# Altium schematic sheet INFO.SchDoc
size 558 x 431 mm; SheetNumber: 2; SheetTotal: 25; Sheet_Name: INFO; Size: 11x17
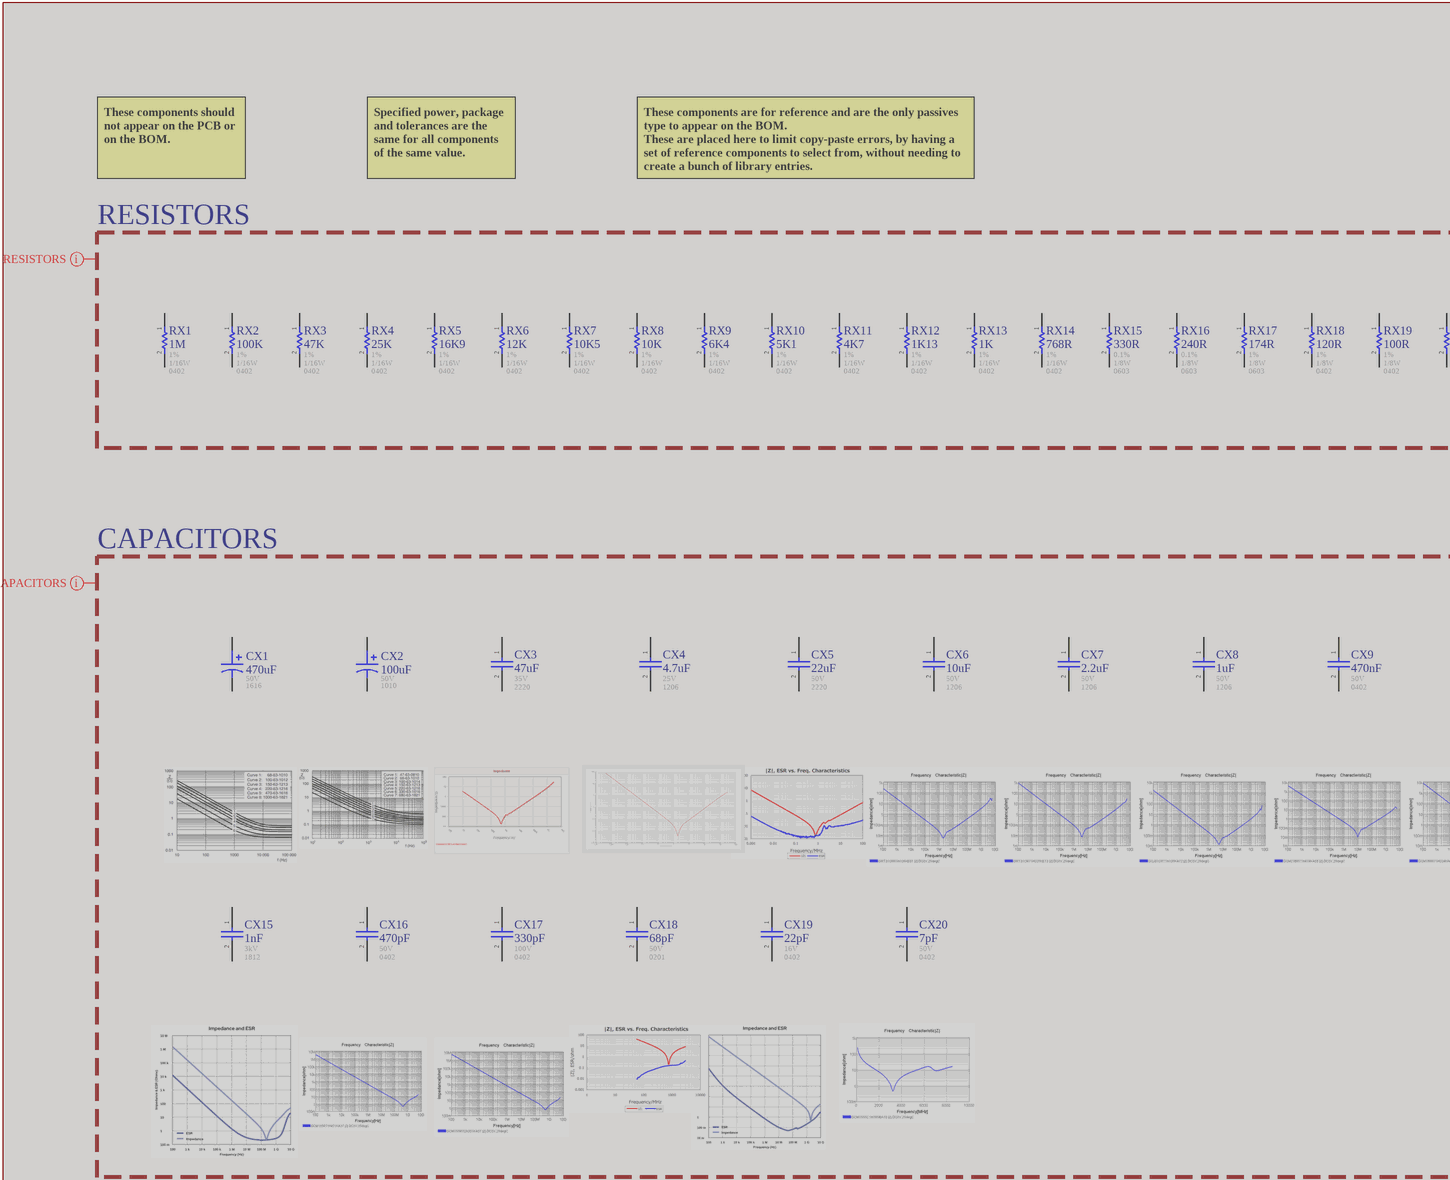
[diagram p0: INFO.SchDoc, top left]
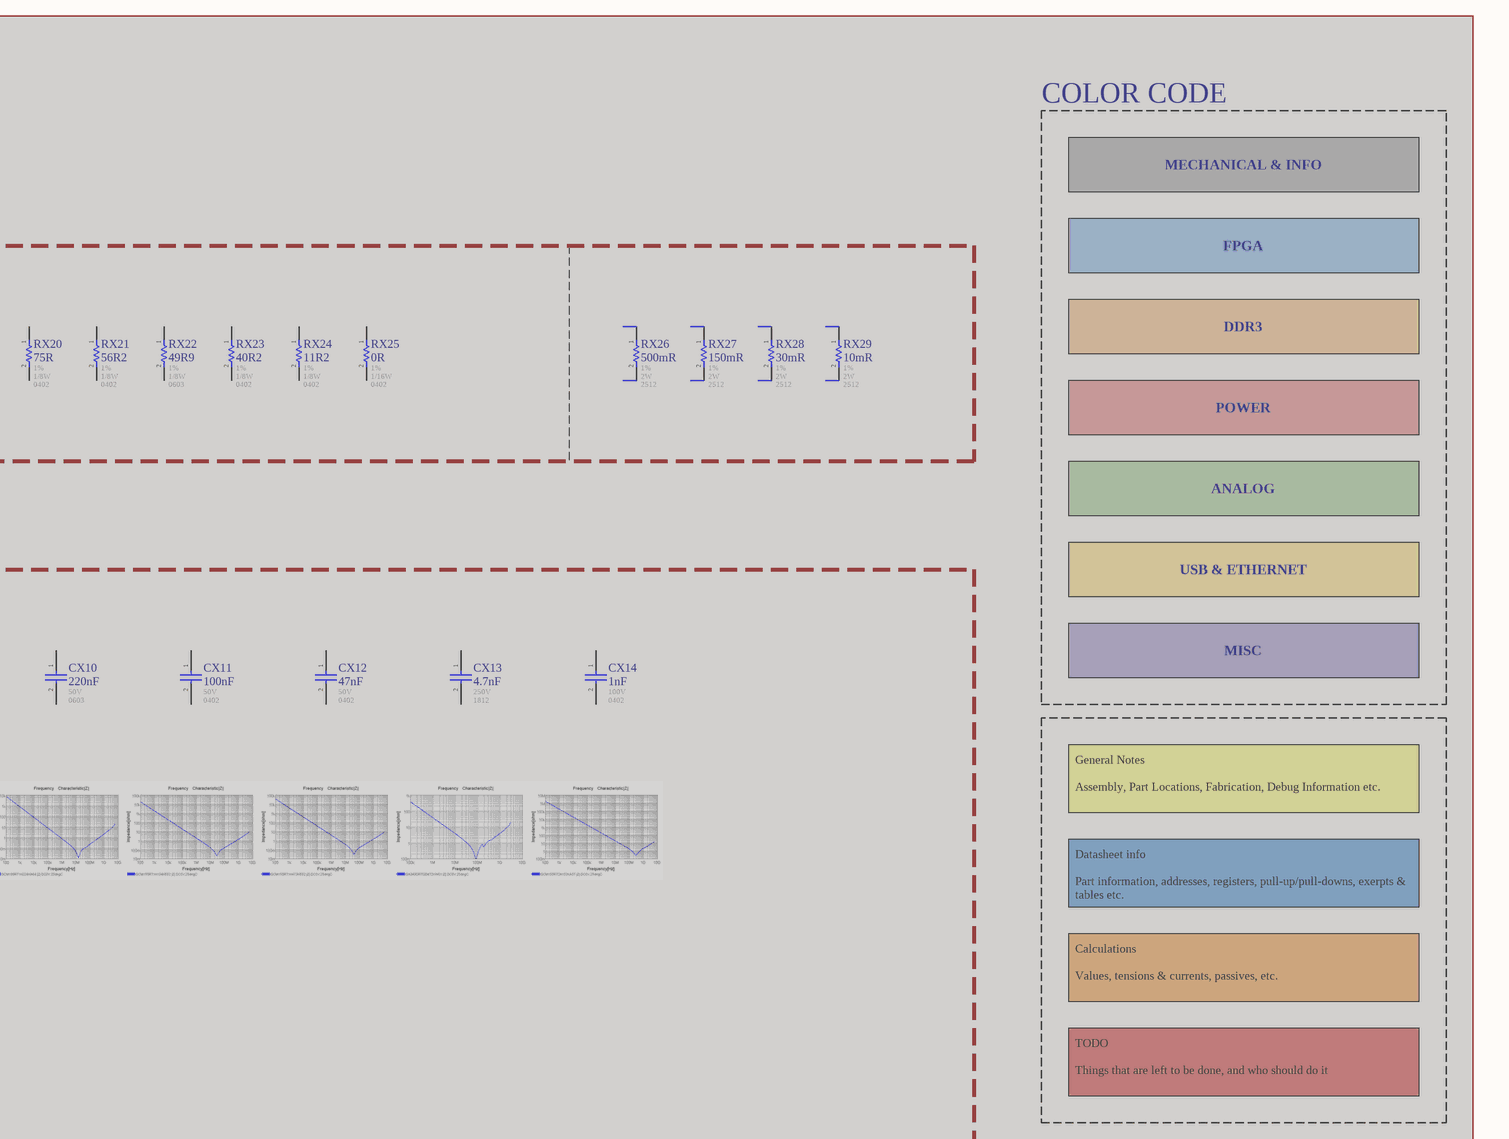
[diagram p1: INFO.SchDoc, top right]
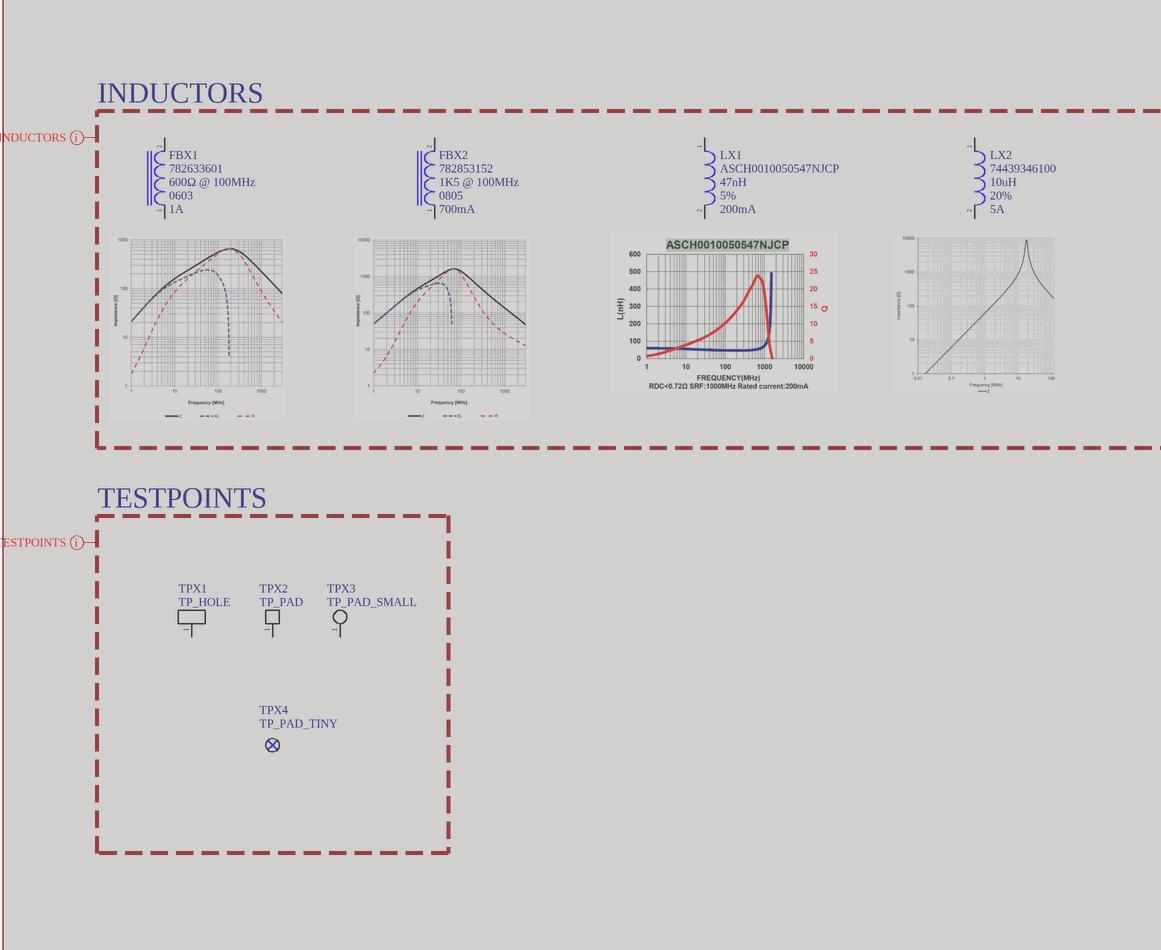
[diagram p2: INFO.SchDoc, bottom left]
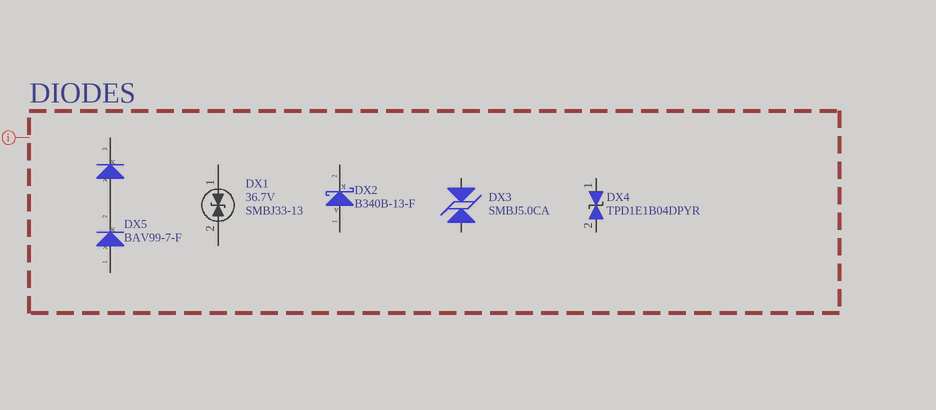
[diagram p3: INFO.SchDoc, bottom right]

## Parts
CX1  value 470uF  Voltage: 50V  Package: 1616  [CAP_ALU_1616_vishay]  (hidden comment: MAL214699108E3)  (masked out: inside a compile mask, not in the netlist)
CX2  value 100uF  Voltage: 50V  Package: 1010  [CAP_ALU_1010_vishay]  (hidden comment: MAL215099101E3)  (masked out: inside a compile mask, not in the netlist)
CX3  47uF  Voltage - Rated: 35V  Footprint: 2220  [CAP_2220]  (masked out: inside a compile mask, not in the netlist)
CX4  4.7uF  Voltage - Rated: 25V  Footprint: 1206  [CAP_1206]  (masked out: inside a compile mask, not in the netlist)
CX5  22uF  Voltage - Rated: 50V  Footprint: 2220  [CAP_2220]  (masked out: inside a compile mask, not in the netlist)
CX6  10uF  Voltage - Rated: 50V  Footprint: 1206  [CAP_1206]  (masked out: inside a compile mask, not in the netlist)
CX7  2.2uF  Voltage - Rated: 50V  Footprint: 1206  [CAP_1206]  (masked out: inside a compile mask, not in the netlist)
CX8  1uF  Voltage - Rated: 50V  Footprint: 1206  [CAP_1206]  (masked out: inside a compile mask, not in the netlist)
CX9  470nF  Voltage - Rated: 50V  Footprint: 0402  [CAP_0402]  (masked out: inside a compile mask, not in the netlist)
CX10  220nF  Voltage - Rated: 50V  Footprint: 0603  [CAP_0603]  (masked out: inside a compile mask, not in the netlist)
CX11  100nF  Voltage - Rated: 50V  Footprint: 0402  [CAP_0402]  (masked out: inside a compile mask, not in the netlist)
CX12  47nF  Voltage - Rated: 50V  Footprint: 0402  [CAP_0402]  (masked out: inside a compile mask, not in the netlist)
CX13  4.7nF  Voltage - Rated: 250V  Footprint: 1812  [CAP_1812]  (masked out: inside a compile mask, not in the netlist)
CX14  1nF  Voltage - Rated: 100V  Footprint: 0402  [CAP_0402]  (masked out: inside a compile mask, not in the netlist)
CX15  1nF  Voltage - Rated: 3kV  Footprint: 1812  [CAP_1812]  (masked out: inside a compile mask, not in the netlist)
CX16  470pF  Voltage - Rated: 50V  Footprint: 0402  [CAP_0402]  (masked out: inside a compile mask, not in the netlist)
CX17  330pF  Voltage - Rated: 100V  Footprint: 0402  [CAP_0402]  (masked out: inside a compile mask, not in the netlist)
CX18  68pF  Voltage - Rated: 50V  Footprint: 0201  [CAP_0402]  (masked out: inside a compile mask, not in the netlist)
CX19  22pF  Voltage - Rated: 16V  Footprint: 0402  [CAP_0402]  (masked out: inside a compile mask, not in the netlist)
CX20  7pF  Voltage - Rated: 50V  Footprint: 0402  [CAP_0402]  (masked out: inside a compile mask, not in the netlist)
DX1  SMBJ33-13  Voltage - Breakdown: 36.7V  [DO214AA (SMB)]  (masked out: inside a compile mask, not in the netlist)
DX2  B340B-13-F  [DO214AA (SMB)]  (masked out: inside a compile mask, not in the netlist)
DX3  SMBJ5.0CA  [TVS_PWR_SMBJ5.0CA]  (masked out: inside a compile mask, not in the netlist)
DX4  TPD1E1B04DPYR  [TVS_DATA_TPD1E1B04DPYR]  (masked out: inside a compile mask, not in the netlist)
DX5  BAV99-7-F  [SOT23-3]  (masked out: inside a compile mask, not in the netlist)
FBX1  782633601  Impedance @ Freq: 600Ω @ 100MHz  Package / Case: 0603  Current Rating: 1A  [IND_0603]  (masked out: inside a compile mask, not in the netlist)
FBX2  782853152  Impedance @ Freq: 1K5 @ 100MHz  Package / Case: 0805  Current Rating: 700mA  [IND_0805]  (masked out: inside a compile mask, not in the netlist)
LX1  ASCH0010050547NJCP  Inductance: 47nH  Tolerance: 5%  Current Rating: 200mA  [IND_0402]  (masked out: inside a compile mask, not in the netlist)
LX2  74439346100  Inductance: 10uH  Tolerance: 20%  Current Rating: 5A  [74439346100]  (masked out: inside a compile mask, not in the netlist)
NT30  Net Tie  [NETTIE_20]  (value not drawn)  (net tie, no BOM)  (masked out: inside a compile mask, not in the netlist)
NT31  Net Tie  [NETTIE_20]  (value not drawn)  (net tie, no BOM)  (masked out: inside a compile mask, not in the netlist)
NT32  Net Tie  [NETTIE_20]  (value not drawn)  (net tie, no BOM)  (masked out: inside a compile mask, not in the netlist)
NT33  Net Tie  [NETTIE_20]  (value not drawn)  (net tie, no BOM)  (masked out: inside a compile mask, not in the netlist)
NT34  Net Tie  [NETTIE_20]  (value not drawn)  (net tie, no BOM)  (masked out: inside a compile mask, not in the netlist)
NT35  Net Tie  [NETTIE_20]  (value not drawn)  (net tie, no BOM)  (masked out: inside a compile mask, not in the netlist)
NT36  Net Tie  [NETTIE_20]  (value not drawn)  (net tie, no BOM)  (masked out: inside a compile mask, not in the netlist)
NT37  Net Tie  [NETTIE_20]  (value not drawn)  (net tie, no BOM)  (masked out: inside a compile mask, not in the netlist)
RX1  1M  Tolerance: 1%  Power: 1/16W  Package / Case: 0402  [RES_0402]  (masked out: inside a compile mask, not in the netlist)
RX2  100K  Tolerance: 1%  Power: 1/16W  Package / Case: 0402  [RES_0402]  (masked out: inside a compile mask, not in the netlist)
RX3  47K  Tolerance: 1%  Power: 1/16W  Package / Case: 0402  [RES_0402]  (masked out: inside a compile mask, not in the netlist)
RX4  25K  Tolerance: 1%  Power: 1/16W  Package / Case: 0402  [RES_0402]  (masked out: inside a compile mask, not in the netlist)
RX5  16K9  Tolerance: 1%  Power: 1/16W  Package / Case: 0402  [RES_0402]  (masked out: inside a compile mask, not in the netlist)
RX6  12K  Tolerance: 1%  Power: 1/16W  Package / Case: 0402  [RES_0402]  (masked out: inside a compile mask, not in the netlist)
RX7  10K5  Tolerance: 1%  Power: 1/16W  Package / Case: 0402  [RES_0402]  (masked out: inside a compile mask, not in the netlist)
RX8  10K  Tolerance: 1%  Power: 1/16W  Package / Case: 0402  [RES_0402]  (masked out: inside a compile mask, not in the netlist)
RX9  6K4  Tolerance: 1%  Power: 1/16W  Package / Case: 0402  [RES_0402]  (masked out: inside a compile mask, not in the netlist)
RX10  5K1  Tolerance: 1%  Power: 1/16W  Package / Case: 0402  [RES_0402]  (masked out: inside a compile mask, not in the netlist)
RX11  4K7  Tolerance: 1%  Power: 1/16W  Package / Case: 0402  [RES_0402]  (masked out: inside a compile mask, not in the netlist)
RX12  1K13  Tolerance: 1%  Power: 1/16W  Package / Case: 0402  [RES_0402]  (masked out: inside a compile mask, not in the netlist)
RX13  1K  Tolerance: 1%  Power: 1/16W  Package / Case: 0402  [RES_0402]  (masked out: inside a compile mask, not in the netlist)
RX14  768R  Tolerance: 1%  Power: 1/16W  Package / Case: 0402  [RES_0402]  (masked out: inside a compile mask, not in the netlist)
RX15  330R  Tolerance: 0.1%  Power: 1/8W  Package / Case: 0603  [RES_0603]  (masked out: inside a compile mask, not in the netlist)
RX16  240R  Tolerance: 0.1%  Power: 1/8W  Package / Case: 0603  [RES_0603]  (masked out: inside a compile mask, not in the netlist)
RX17  174R  Tolerance: 1%  Power: 1/8W  Package / Case: 0603  [RES_0603]  (masked out: inside a compile mask, not in the netlist)
RX18  120R  Tolerance: 1%  Power: 1/8W  Package / Case: 0402  [RES_0402]  (masked out: inside a compile mask, not in the netlist)
RX19  100R  Tolerance: 1%  Power: 1/8W  Package / Case: 0402  [RES_0402]  (masked out: inside a compile mask, not in the netlist)
RX20  75R  Tolerance: 1%  Power: 1/8W  Package / Case: 0402  [RES_0402]  (masked out: inside a compile mask, not in the netlist)
RX21  56R2  Tolerance: 1%  Power: 1/8W  Package / Case: 0402  [RES_0402]  (masked out: inside a compile mask, not in the netlist)
RX22  49R9  Tolerance: 1%  Power: 1/8W  Package / Case: 0603  [RES_0603]  (masked out: inside a compile mask, not in the netlist)
RX23  40R2  Tolerance: 1%  Power: 1/8W  Package / Case: 0402  [RES_0402]  (masked out: inside a compile mask, not in the netlist)
RX24  11R2  Tolerance: 1%  Power: 1/8W  Package / Case: 0402  [RES_0402]  (masked out: inside a compile mask, not in the netlist)
RX25  0R  Tolerance: 1%  Power: 1/16W  Package / Case: 0402  [RES_0402]  (masked out: inside a compile mask, not in the netlist)
RX26  500mR  Tolerance: 1%  Power: 2W  Package / Case: 2512  [RES_2512]  (masked out: inside a compile mask, not in the netlist)
RX27  150mR  Tolerance: 1%  Power: 2W  Package / Case: 2512  [RES_2512]  (masked out: inside a compile mask, not in the netlist)
RX28  30mR  Tolerance: 1%  Power: 2W  Package / Case: 2512  [RES_2512]  (masked out: inside a compile mask, not in the netlist)
RX29  10mR  Tolerance: 1%  Power: 2W  Package / Case: 2512  [RES_2512]  (masked out: inside a compile mask, not in the netlist)
TPX1  TP_HOLE  [TP_HOLE]  (no BOM)  (masked out: inside a compile mask, not in the netlist)
TPX2  TP_PAD  [TP_PAD]  (no BOM)  (masked out: inside a compile mask, not in the netlist)
TPX3  TP_PAD_SMALL  [TP_PAD_SMALL]  (no BOM)  (masked out: inside a compile mask, not in the netlist)
TPX4  TP_PAD_TINY  [TP_PAD_TINY]  (no BOM)  (masked out: inside a compile mask, not in the netlist)

## Layout directives
CompClassName: DNF_PAGE: (no net found under the mark)

## Notes on the sheet
- COLOR CODE
- These components should not appear on the PCB or on the BOM.
- Specified power, package and tolerances are the same for all components of the same value.
- These components are for reference and are the only passives type to appear on the BOM.
  These are placed here to limit copy-paste errors, by having a set of reference components to select from, without needing to create a bunch of library entries.
- MECHANICAL & INFO
- RESISTORS
- FPGA
- DDR3
- POWER
- ANALOG
- CAPACITORS
- USB & ETHERNET
- MISC
- General Notes
  Assembly, Part Locations, Fabrication, Debug Information etc.
- Datasheet info
  Part information, addresses, registers, pull-up/pull-downs, exerpts & tables etc.
- Calculations
  Values, tensions & currents, passives, etc.
- TODO
  Things that are left to be done, and who should do it
- (near FBX1) INDUCTORS
- DIODES
- TESTPOINTS
- Sheet Name
- Project Title
- Global Project
- Revision
- Size
- Date
- Group
- Sheet
- of
- Filename
- Designers

## Library data of the parts
CX1 = CAP_ALU_MAL214699108E3: CAP - ALU 470uF 20% 50V - 1616; Current: 1.3A; Mfg: Vishay Dale; Mfg Part Number: MAL214699108E3; HelpURL: http://www.vishay.com/docs/28403/146cti.pdf; CreatedBy: Jonathan Bouchard; Temperature: -55°C to 125°C; Power: *; Supplier 1: Digikey; Supplier Part Number 1: 4442PHCT-ND; Precision: 20%
CX2 = CAP_ALU_MAL215099101E3: CAP - ALU 100uF 20% 50V - 1010; Current: 490mA; Mfg: Vishay Dale; Mfg Part Number: MAL215099101E3; HelpURL: http://www.vishay.com/docs/28395/150crz.pdf; CreatedBy: Jonathan Bouchard; Temperature: -55°C to 125°C; Power: *; Supplier 1: Digikey; Supplier Part Number 1: 4399PHDKR-ND; Precision: 20%
CX3 = CAP_CER: CGA9N1X7R1V476M230KC / 2220 47uF 20% X7R Ceramic Capacitor; Mfr: TDK; Operating Temperature: -55C - 125C; Temperature Coefficient: X7R; ComponentLink1Description: Digikey; ComponentLink1URL: https://www.digikey.ca/en/products/detail/tdk-corporation/CGA9N1X7R1V476M230KC/15930202; ComponentLink2Description: Datasheet; ComponentLink2URL: https://product.tdk.com/system/files/dam/doc/product/capacitor/ceramic/mlcc/catalog/mlcc_automotive_general_en.pdf; Tolerance: 20%; Ratings: AEC-Q200; Part#: CGA9N1X7R1V476M230KC; ComponentLink3Description: TDK; ComponentLink3URL: https://product.tdk.com/en/search/capacitor/ceramic/mlcc/info?part_no=CGA9N1X7R1V476M230KC; ComponentLink4Description: Octopart; ComponentLink4URL: https://octopart.com/cga9n1x7r1v476m230kc-tdk-122377816?r=sp; Supplier 1: Newark; Supplier Part Number 1: 57AK9414
CX4 = CAP_CER: CGA8L2X7R1E475M160KA / 1812 4.7uF 20% X7R Ceramic Capacitor; Mfr: TDK; Part#: CGA9N1X7R1V476M230KC; Operating Temperature: -55C - 125C; Temperature Coefficient: X7R; ComponentLink1Description: Digikey; ComponentLink1URL: https://www.digikey.ca/en/products/detail/tdk-corporation/CGA9N1X7R1V476M230KC/15930202; ComponentLink2Description: Datasheet; ComponentLink2URL: https://product.tdk.com/system/files/dam/doc/product/capacitor/ceramic/mlcc/catalog/mlcc_automotive_general_en.pdf; Tolerance: 20%; Ratings: AEC-Q200; ComponentLink3Description: TDK; ComponentLink3URL: https://product.tdk.com/en/search/capacitor/ceramic/mlcc/info?part_no=CGA9N1X7R1V476M230KC; ComponentLink4Description: Octopart; ComponentLink4URL: https://octopart.com/cga9n1x7r1v476m230kc-tdk-122377816?r=sp; Supplier 1: Newark; Supplier Part Number 1: 57AK9414
CX5 = CAP_CER: CGA9P3X7R1H226M250KB / 2220 22uF 20% X7R Ceramic Capacitor; Mfr: TDK; Operating Temperature: -55C - 125C; Temperature Coefficient: X7R; ComponentLink1Description: Digikey; ComponentLink1URL: https://www.digikey.ca/en/products/detail/tdk-corporation/CGA9P3X7R1H226M250KB/10240627; ComponentLink2Description: Datasheet; ComponentLink2URL: https://product.tdk.com/system/files/dam/doc/product/capacitor/ceramic/mlcc/charasheet/cga9p3x7r1h226m250kb.pdf; Tolerance: 20%; Ratings: AEC-Q200; Part#: CGA9P3X7R1H226M250KB; Supplier 1: Arrow Electronics; Supplier Part Number 1: CGA9P3X7R1H226M250KB; ComponentLink3Description: TDK; ComponentLink3URL: https://product.tdk.com/en/search/capacitor/ceramic/mlcc/info?part_no=CGA9P3X7R1H226M250KB; ComponentLink4Description: Octopart; ComponentLink4URL: https://octopart.com/cga9p3x7r1h226m250kb-tdk-102764996?r=sp
CX6 = CAP_CER: GRT31CR61H106KE01L / 1206 10uF 10% X5R Ceramic Capacitor; Mfr: Murata; Operating Temperature: -55C - 85C; Temperature Coefficient: X5R; ComponentLink1Description: Digikey; ComponentLink1URL: [Digikey Link]; ComponentLink2Description: Datasheet; ComponentLink2URL: [Datasheet Link]; Tolerance: 10%; Ratings: AEC-Q200; Supplier 1: Arrow Electronics; Supplier Part Number 1: GRT31CR61H106KE01L; Part#: GRT31CR61H106KE01L
CX7 = CAP_CER: GRT31CR71H225KE13L / 1206 2.2uF 10% X7R Ceramic Capacitor; Mfr: Murata; Operating Temperature: -55C - 125C; Temperature Coefficient: X7R; ComponentLink1Description: Digikey; ComponentLink1URL: https://www.digikey.ca/en/products/detail/murata-electronics/GRT31CR71H225KE13L/10700891; Part#: GRT31CR71H225KE13L; ComponentLink2Description: Datasheet; ComponentLink2URL: https://search.murata.co.jp/Ceramy/image/img/A01X/G101/ENG/GRT31CR71H225KE13-01A.pdf; ComponentLink3Description: Octopart; ComponentLink3URL: https://octopart.com/grt31cr71h225ke13l-murata-76584457?r=sp; ComponentLink4Description: Murata; ComponentLink4URL: https://www.murata.com/en-us/products/productdetail?partno=GRT31CR71H225KE13%23; Tolerance: 10%; Ratings: AEC-Q200
CX8 = CAP_CER: GCJ31CR71H105KA12L / 1206 1uF 10% X7R Ceramic Capacitor; Mfr: Murata; Operating Temperature: -55C - 125C; Temperature Coefficient: X7R; ComponentLink1Description: Digikey; ComponentLink1URL: [Digikey Link]; Part#: GCJ31CR71H105KA12L; ComponentLink2Description: Datasheet; ComponentLink2URL: [Datasheet Link]; Tolerance: 10%; Ratings: AEC-Q200
CX9 = CAP_CER: CGA3E3X7R1H474K080AB / 0603 470nF 10% X7R Ceramic Capacitor; Mfr: TDK; Operating Temperature: -55C - 125C; Temperature Coefficient: X7R; ComponentLink1Description: Digikey; ComponentLink1URL: [Digikey Link]; Part#: CGA3E3X7R1H474K080AB; ComponentLink2Description: Datasheet; ComponentLink2URL: [Datasheet Link]; Tolerance: 10%; Ratings: AEC-Q200
CX10 = CAP_CER: GCM188R71H224KA64D / 0603 220nF 10% X7R Ceramic Capacitor; Mfr: Murata; Operating Temperature: -55C - 125C; Temperature Coefficient: X7R; ComponentLink1Description: Digikey; ComponentLink1URL: [Digikey Link]; Part#: GCM188R71H224KA64D; ComponentLink2Description: Datasheet; ComponentLink2URL: [Datasheet Link]; Tolerance: 10%; Ratings: AEC-Q200
CX11 = CAP_CER: GCM155R71H104KE02J / 0402 100nF 10% X7R Ceramic Capacitor; Mfr: Murata; Operating Temperature: -55C - 125C; Temperature Coefficient: X7R; ComponentLink1Description: Digikey; ComponentLink1URL: [Digikey Link]; Part#: GCM155R71H104KE02J; ComponentLink2Description: Datasheet; ComponentLink2URL: [Datasheet Link]; Tolerance: 10%; Ratings: AEC-Q200
CX12 = CAP_CER: GCM155R71H473KE02J / 0402 47nF 10% X7R Ceramic Capacitor; Mfr: Murata; Operating Temperature: -55C - 125C; Temperature Coefficient: X7R; ComponentLink1Description: Digikey; ComponentLink1URL: [Digikey Link]; Part#: GCM155R71H473KE02J; ComponentLink2Description: Datasheet; ComponentLink2URL: [Datasheet Link]; Tolerance: 10%; Ratings: AEC-Q200
CX13 = CAP_CER: GA343DR7GD472KW01L / 0402 4.7nF 10% X7R 1812 250VAC Ceramic Capacitor; Mfr: Murata; Ratings: Y3 - Safety; Operating Temperature: -55C - 125C; Temperature Coefficient: X7R; ComponentLink1Description: Digikey; ComponentLink1URL: https://www.digikey.ca/en/products/detail/murata-electronics/GA343DR7GD472KW01L/789292; ComponentLink2Description: Datasheet; ComponentLink2URL: https://search.murata.co.jp/Ceramy/image/img/A01X/G101/ENG/GA343DR7GD472KW01-01.pdf; ComponentLink3Description: Octopart; ComponentLink3URL: https://octopart.com/ga343dr7gd472kw01l-murata-197048?r=sp; Tolerance: 10%; Part#: GA343DR7GD472KW01L; ComponentLink4Description: Murata; ComponentLink4URL: https://www.murata.com/en-us/products/productdetail?partno=GA343DR7GD472KW01%23
CX14 = CAP_CER: GCM155R72A102KA37D / 0402 1nF 10% X7R Ceramic Capacitor; Mfr: Murata; Operating Temperature: -55C - 125C; Temperature Coefficient: X7R; ComponentLink1Description: Digikey; ComponentLink1URL: [Digikey Link]; Part#: GCM155R72A102KA37D; ComponentLink2Description: Datasheet; ComponentLink2URL: [Datasheet Link]; Tolerance: 10%; Ratings: AEC-Q200
CX15 = CAP_CER: C1812C102KHRACAUTO / 0402 470pF 10% X7R Ceramic Capacitor; Mfr: KEMET; Operating Temperature: -55C - 125C; Temperature Coefficient: X7R; ComponentLink1Description: Digikey; ComponentLink1URL: https://www.digikey.com/en/products/detail/kemet/C1812C102KHRACAUTO/8109956; Part#: C1812C102KHRACAUTO; ComponentLink2Description: Datasheet; ComponentLink2URL: https://connect.kemet.com:7667/gateway/IntelliData-ComponentDocumentation/1.0/download/datasheet/C1812C102KHRACAUTO; Tolerance: 10%; Ratings: AEC-Q200; ComponentLink3Description: KEMET; ComponentLink3URL: https://www.kemet.com/en/us/capacitors/ceramic/product/C1812C102KHRACAUTO.html; ComponentLink4Description: Octopart; ComponentLink4URL: https://octopart.com/c1812c102khracauto-kemet-67309371?r=sp; Features: Low ESL, High Voltage; Supplier 1: Mouser; Supplier Part Number 1: 80-C1812C102KHRAUTO
CX16 = CAP_CER: GCM155R71H471KA37J / 0402 470pF 10% X7R Ceramic Capacitor; Mfr: Murata; Operating Temperature: -55C - 125C; Temperature Coefficient: X7R; ComponentLink1Description: Digikey; ComponentLink1URL: https://www.digikey.ca/en/products/detail/murata-electronics/GCM155R71H471KA37J/2591324; Part#: GCM155R71H471KA37J; ComponentLink2Description: Datasheet; ComponentLink2URL: https://search.murata.co.jp/Ceramy/image/img/A01X/G101/ENG/GCM155R71H471KA37-01A.pdf; Tolerance: 10%; Ratings: AEC-Q200; ComponentLink3Description: Murata; ComponentLink3URL: https://www.murata.com/en-us/products/productdetail?partno=GCM155R71H471KA37%23; ComponentLink4Description: Octopart; ComponentLink4URL: https://octopart.com/gcm155r71h471ka37j-murata-17803389?r=sp
CX17 = CAP_CER: GCM155R72A331KA37D / 0402 330pF 10% X7R Ceramic Capacitor; Mfr: Murata; Operating Temperature: -55C - 125C; Temperature Coefficient: X7R; ComponentLink1Description: Digikey; ComponentLink1URL: https://www.digikey.ca/en/products/detail/murata-electronics/GCM155R72A331KA37D/2591348; Part#: GCM155R72A331KA37D; ComponentLink2Description: Datasheet; ComponentLink2URL: https://search.murata.co.jp/Ceramy/image/img/A01X/G101/ENG/GCM155R72A331KA37-01A.pdf; Tolerance: 10%; Ratings: AEC-Q200; ComponentLink3Description: Murata; ComponentLink3URL: https://www.murata.com/en-us/products/productdetail?partno=GCM155R72A331KA37%23; ComponentLink4Description: Octopart; ComponentLink4URL: https://octopart.com/gcm155r72a331ka37d-murata-18331888?r=sp; Supplier 1: Arrow Electronics; Supplier Part Number 1: GCM155R72A331KA37D
CX18 = CAP_CER: 0201 68pF 5% C0G 50V Ceramic Capacitor / CGA1A2C0G1H680J030BA; Mfr: TDK; Operating Temperature: -55C - 125C; Temperature Coefficient: C0G; ComponentLink1Description: Digikey; ComponentLink1URL: https://www.digikey.ca/en/products/detail/tdk-corporation/CGA1A2C0G1H680J030BA/3648597; Part#: CGA1A2C0G1H680J030BA; ComponentLink2Description: Datasheet; ComponentLink2URL: https://product.tdk.com/system/files/dam/doc/product/capacitor/ceramic/mlcc/charasheet/cga1a2c0g1h680j030ba.pdf; Tolerance: 5%; Ratings: AEC-Q200; ComponentLink3Description: Octopart; ComponentLink3URL: https://octopart.com/cga1a2c0g1h680j030ba-tdk-26014371?r=sp; ComponentLink4Description: TDK; ComponentLink4URL: https://product.tdk.com/en/search/capacitor/ceramic/mlcc/info?part_no=CGA1A2C0G1H680J030BA; Supplier 1: Arrow Electronics; Supplier Part Number 1: CGA1A2C0G1H680J030BA
CX19 = CAP_CER: 0402 22pF 10% X7R 16V Ceramic Capacitor / C0402C220K4RACAUTO; Mfr: KEMET; Operating Temperature: -55C - 125C; Temperature Coefficient: X7R; ComponentLink1Description: Digikey; ComponentLink1URL: https://www.digikey.ca/en/products/detail/kemet/c0402c220k4racauto/11676432; Part#: C0402C220K4RACAUTO; ComponentLink2Description: Datasheet; ComponentLink2URL: https://connect.kemet.com:7667/gateway/IntelliData-ComponentDocumentation/1.0/download/datasheet/C0402C220K4RACAUTO; Tolerance: 10%; Ratings: AEC-Q200; ComponentLink3Description: Octopart; ComponentLink3URL: https://octopart.com/c0402c220k4racauto-kemet-91893749?r=sp; ComponentLink4Description: Kemet; ComponentLink4URL: https://www.kemet.com/en/us/capacitors/ceramic/product/C0402C220K4RACAUTO.html; ComponentLink5Description: Specsheet; ComponentLink5URL: https://search.kemet.com/component-documentation/download/specsheet/C0402C220K4RACAUTO; Supplier 1: Mouser; Supplier Part Number 1: 80-C0402C220K4RAUTO
CX20 = CAP_CER: 0402 7pF C0G Ceramic Capacitor / GCM1555C1H7R0BA16D; Mfr: Murata; Operating Temperature: -55C - 125C; Temperature Coefficient: C0G; ComponentLink1Description: Digikey; ComponentLink1URL: https://www.digikey.ca/en/products/detail/murata-electronics/GCM1555C1H7R0BA16D/11618476; ComponentLink2Description: Datasheet; ComponentLink2URL: https://search.murata.co.jp/Ceramy/image/img/A01X/G101/ENG/GCM1555C1H7R0BA16-01.pdf
DX1 = DIODE_TVS: 53.3V Clamp 11.3A Ipp Tvs Diode Surface Mount SMB; Mfr: SMBJ33CAQ-13-F; Voltage - Reverse: 33V; Operating Temperature: *; Package / Case: SMB; Current: 11.3A; ComponentLink1Description: Digikey; ComponentLink1URL: https://www.digikey.ca/en/products/detail/diodes-incorporated/SMBJ33CAQ-13-F/9738859
DX2 = DIODE_SHOTTKEY: VS-15MQ040HM3/5AT; Diode Type: Schottky; Current: 1.5A; Reverse Voltage: 40V; Forward Voltage: 430mV @ 1.5A; Qualification: AEC-Q101; Package / Case: SMA; ComponentLink1Description: Digikey; ComponentLink1URL: https://www.digikey.ca/en/products/detail/diodes-incorporated/B340B-13-F/768869; ComponentLink2Description: Octopart; ComponentLink2URL: https://octopart.com/b340b-13-f-diodes+inc.-325817?r=sp
DX3 = TVS_PWR_SMBJ5.0CA: TVS - BIDIR 5V 9.2V 600W - DO214AA; Manufacturer #1: Littelfuse Inc.; Value: Vbr = 6.4V -  Clamp = 9.2V; Voltage Rating: 5V Standoff; Current Rating: 65.3 A (Ipp); Power Max: 600W (Pppm); GRAMS Lib Spec: 2.8; Magnetic Material: UNKNOWN; Polarized: NO; Tolerance: *; HelpURL: http://www.littelfuse.com/~/media/electronics/datasheets/tvs_diodes/littelfuse_tvs_diode_smbj_datasheet.pdf.pdf; CreatedBy/Date: Jonathan Bouchard - 2019-03-22; VerifiedBy: Nicolas V. (2019-05-06); Temperature: -65°C ~ 150°C (TJ); Package: DO214AA; Manufacturer #2: *; Note: *; Assembly Type: SMD; Part Number #2: *; Part Number #1: SMBJ5.0CA; Supplier 1: Digi-Key; Supplier Part Number 1: SMBJ5.0CALFCT-ND; Cryo: UNKNOWN
DX4 = TVS_DATA_TPD1E1B04DPYR: TVS - TVS DIODE 3.6V 8.5V - 0402; Manufacturer #1: Texas Instruments; Current Rating: 6.3Apeak; Power Max: 50Wpeak; GRAMS Lib Spec: 2.8; Magnetic Material: Unknown; Polarized: No; Value: *; Tolerance: *; Voltage Rating: 3.6V; HelpURL: http://www.ti.com/lit/ds/symlink/tpd1e1b04.pdf; CreatedBy/Date: Keven Deslandes - 2018/10/19; VerifiedBy: Caroline Paulin - 28 janv 2019; Temperature: -40°C ~ 125°C (TA); Package: 0402; Manufacturer #2: *; Note: *; Assembly Type: SMD; Part Number #2: *; Part Number #1: TPD1E1B04DPYR; Supplier 1: Digi-Key; Supplier Part Number 1: 296-47364-1-ND; Cryo: UNKNOWN
DX5 = DIODE_TVS_DUAL: Diode Array 1 Pair Series Connection 75 V 300mA (DC) Surface Mount TO-236-3, SC-59, SOT-23-3; Mfr: Diodes Incorporated; Voltage - DC Reverse: 75V; Voltage - Forward: 1.25V @ 150mA; Reverse Recovery Time: 4ns; Capacitance: 2pF; Current - Reverse Leakage: 2.5µA @ 75V; Operating Temperature: -65C - 150C; Package / Case: SOT-23-3; Current: 300mA; ComponentLink1Description: Digikey; ComponentLink1URL: https://www.digikey.ca/en/products/detail/diodes-incorporated/BAV99-7-F/815018; ComponentLink2Description: Datasheet; ComponentLink2URL: https://www.diodes.com/assets/Datasheets/BAV99.pdf; ComponentLink3Description: Octopart; ComponentLink3URL: https://octopart.com/bav99-7-f-diodes+inc.-326328; Supplier 1: Future Electronics; Supplier Part Number 1: 3851920
FBX1 = FERRITE_BEAD: 600 Ohms @ 100 MHz 1 Signal Line Ferrite Bead 0603 (1608 Metric) 1A 200mOhm; Manufacturer: Wurth Elektronik; Resistance: 200mR; Operating Temperature: -55C - 125C; Rating: AEC-Q200; ComponentLink1Description: Digikey; ComponentLink1URL: https://www.digikey.ca/en/products/detail/w%C3%BCrth-elektronik/782633601/5168802; ComponentLink3Description: Octopart; ComponentLink3URL: https://octopart.com/782633601-wurth+elektronik-56466764; Supplier 1: Digikey; Supplier Part Number 1: 732-6703-1-ND; ComponentLink5Description: Datasheet; ComponentLink5URL: https://www.we-online.com/components/products/datasheet/782633601.pdf
FBX2 = FERRITE_BEAD: 600 Ohms @ 100 MHz 1 Signal Line Ferrite Bead 0603 (1608 Metric) 1A 200mOhm; Manufacturer: Wurth Elektronik; Resistance: 350mR; Operating Temperature: -55C - 125C; Rating: AEC-Q200; ComponentLink1Description: Digikey; ComponentLink1URL: https://www.digikey.ca/en/products/detail/w%C3%BCrth-elektronik/782853152/5168812; ComponentLink3Description: Octopart; ComponentLink3URL: https://octopart.com/782853152-wurth+elektronik-56466774?r=sp; ComponentLink5Description: Datasheet; ComponentLink5URL: https://www.we-online.com/en/components/products/datasheet/782853152.pdf
LX1 = INDUCTOR: Generic Inductor; Resistance: 2R; Q @ Freq: 8 @ 100MHz; Material: Ceramic; Operating Temperature: -40C - 125C; Package / Case: 0402; Ratings: AEC-Q200; ComponentLink1Description: Digikey; ComponentLink1URL: https://www.digikey.ca/en/products/detail/pulse-electronics/asch0010050547njcp/16505828; ComponentLink2Description: Datasheet; ComponentLink2URL: https://productfinder.pulseelectronics.com/api/open/part-attachments/datasheet/ASCH0010050547NJCP; ComponentLink3Description: Octopart; ComponentLink3URL: https://octopart.com/asch0010050547njcp-pulse-128075783?r=sp; Supplier 1: Mouser; Supplier Part Number 1: 673-ASCH10050547NJCP
LX2 = INDUCTOR: Generic Inductor; Resistance: 25.5mR; Material: Metal Composite; Operating Temperature: -40C - 125C; Package / Case: Nonstandard; Ratings: AEC-Q200; Q @ Freq: -; ComponentLink1Description: Digikey; ComponentLink1URL: https://www.digikey.ca/en/products/detail/w%C3%BCrth-elektronik/74439346100/6236306; ComponentLink2Description: Datasheet; ComponentLink2URL: https://www.we-online.com/components/products/datasheet/74439346100.pdf; ComponentLink3Description: Octopart; ComponentLink3URL: https://octopart.com/74439346100-wurth+elektronik-75811204?r=sp; Supplier 1: Digikey; Supplier Part Number 1: 732-10707-1-ND
NT30-NT37 = NET_TIE_SMALL
RX1 = RESISTOR: 1M 0402 1% 1/16W Resistor; Automotive: AEC-Q200; Operating Temperature: *; # Digikey: *; ComponentLink1Description: Digikey; ComponentLink1URL: *; # Manufacturer: *
RX2-RX14 RX16-RX25 = RESISTOR: Automotive: AEC-Q200; Operating Temperature: *; # Digikey: *; ComponentLink1Description: Digikey; ComponentLink1URL: *; # Manufacturer: *
RX15 = RESISTOR: 1M 0603 1% 1/16W Resistor; Automotive: AEC-Q200; Operating Temperature: *; # Digikey: *; ComponentLink1Description: Digikey; ComponentLink1URL: *; # Manufacturer: *
RX26 = RESISTOR: Part #: CSRN2512FKR500; Automotive: AEC-Q200; Operating Temperature: -55C - 155C; ComponentLink1Description: Digikey; ComponentLink1URL: https://www.digikey.ca/fr/products/detail/stackpole-electronics-inc/CSRN2512FKR500/1742768
RX27 = RESISTOR: CSRN2512FKR150; Automotive: AEC-Q200; Operating Temperature: -55C - 155C; ComponentLink1Description: Digikey; ComponentLink1URL: https://www.digikey.ca/fr/products/detail/stackpole-electronics-inc/CSRN2512FKR150/1788109; Part #: CSRN2512FKR150
RX28 = RESISTOR: CSRN2512FK30L0; Automotive: AEC-Q200; Operating Temperature: -55C - 155C; ComponentLink1Description: Digikey; ComponentLink1URL: https://www.digikey.ca/fr/products/detail/stackpole-electronics-inc/CSRN2512FK30L0/1646107; Part #: CSRN2512FK30L0
RX29 = RESISTOR: CSRN2512FK10L0; Automotive: AEC-Q200; Operating Temperature: -55C - 155C; ComponentLink1Description: Digikey; ComponentLink1URL: https://www.digikey.ca/fr/products/detail/stackpole-electronics-inc/CSRN2512FK10L0/1646104; Part #: CSRN2512FK10L0
TPX1 = TESTPOINT_HOLE: Test Point
TPX2 = TESTPOINT_PAD: Test Point
TPX3 = TESTPOINT_PAD_SMALL: Test Point
TPX4 = TESTPOINT_PAD_TINY: Test Point